# Altium project MiniBall.PrjPCB
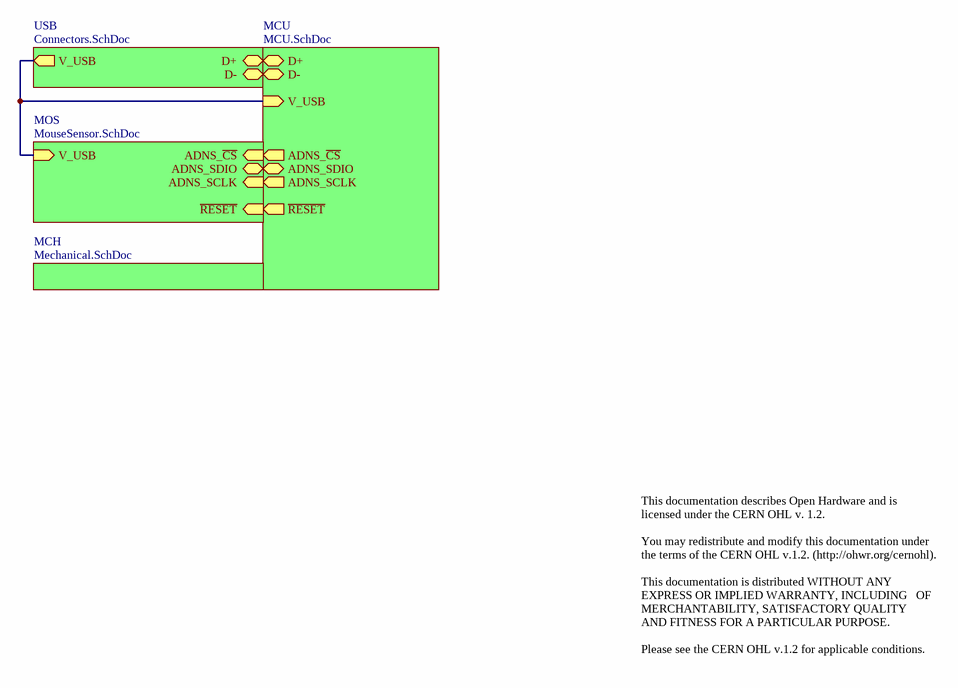
[diagram p0: MiniBall.SchDoc]
5 sheets, 44 parts. Net scope: hierarchical (ports join the sheet entries above them; power ports are global).
Board file: MiniBall.PcbDoc
Sheets:
  MiniBall.SchDoc
    USB = Connectors.SchDoc
    MCU = MCU.SchDoc
    MCH = Mechanical.SchDoc
    MOS = MouseSensor.SchDoc

## Sheet MiniBall.SchDoc
size Letter; CompanyName: Ploopy Corporation; Organization: Ploopy Corporation; Address1: 137-1140 Burnhamthorpe Road W; Address2: Mississauga; Address3: Ontario; Address4: Canada L5C 0A3; DocumentNumber: 1; Revision: R1.001; SheetNumber: 1; SheetTotal: 5

### Sub-sheets
MCH = Mechanical.SchDoc: no entries
MCU = MCU.SchDoc: D+ (bidir), D- (bidir), V_USB (in), ~{RESET} (out), ADNS_SDIO (bidir), ADNS_~{CS} (out), ADNS_SCLK (out)
MOS = MouseSensor.SchDoc: ~{RESET} (in), V_USB (in), ADNS_~{CS} (in), ADNS_SDIO (bidir), ADNS_SCLK (in)
USB = Connectors.SchDoc: D+ (bidir), V_USB (out), D- (bidir)

### Nets
~{RESET}: sheet MCU/~{RESET}, sheet MOS/~{RESET}
V_USB: sheet USB/V_USB, sheet MCU/V_USB, sheet MOS/V_USB
NetR6_2: sheet USB/D-, sheet MCU/D-
NetR7_2: sheet USB/D+, sheet MCU/D+
NetU1_12: sheet MCU/ADNS_SCLK, sheet MOS/ADNS_SCLK
NetU1_28: sheet MCU/ADNS_~{CS}, sheet MOS/ADNS_~{CS}
NetU1_31: sheet MCU/ADNS_SDIO, sheet MOS/ADNS_SDIO

### Notes on the sheet
- This documentation describes Open Hardware and is licensed under the CERN OHL v. 1.2.
  You may redistribute and modify this documentation under the terms of the CERN OHL v.1.2. (http://ohwr.org/cernohl).
  This documentation is distributed WITHOUT ANY EXPRESS OR IMPLIED WARRANTY, INCLUDING   OF MERCHANTABILITY, SATISFACTORY QUALITY   AND FITNESS FOR A PARTICULAR PURPOSE.
  Please see the CERN OHL v.1.2 for applicable conditions.
- Copyright Ploopy Corporation 2021
- Licensed under the CERN OHL v. 1.2
- http://ohwr.org/cernohl
- Title:
- PCB:
- Version:
- Ploopy Corporation
- Mississauga ON L5C 0A3
- 137-1140 Burnhamthorpe Road W
- Date:
- Time:
- Sheet
- of
- Canada

## Sheet Connectors.SchDoc
size Letter; CompanyName: Ploopy Corporation; Organization: Ploopy Corporation; Address1: 137-1140 Burnhamthorpe Road W; Address2: Mississauga; Address3: Ontario; Address4: Canada L5C 0A3; DocumentNumber: 2; Revision: R1.001; SheetNumber: 2; SheetTotal: 5
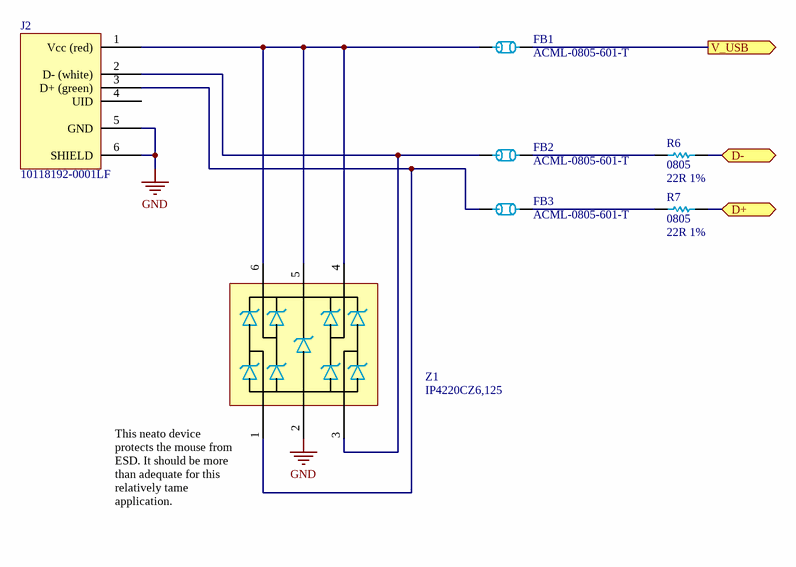
[diagram p1: Connectors.SchDoc]

### Parts
FB1  ACML-0805-601-T  [0805]
FB2  ACML-0805-601-T  [0805]
FB3  ACML-0805-601-T  [0805]
J2  10118192-0001LF  [10118192-0001LF]
R6  0805  value 22R 1%  [0805]
R7  0805  value 22R 1%  [0805]
Z1  IP4220CZ6,125  [PESD3V3S4UD - SOT95P275X110-6N]

### Ports
D+ (bidir), D- (bidir), V_USB (out)

### Nets
GND: J2.5(GND) J2.6(SHIELD) Z1.2
V_USB: FB1.2 ; port V_USB
NetFB1_1: FB1.1 J2.1(Vcc_(red)) Z1.4 Z1.5 Z1.6
NetFB2_1: FB2.1 J2.2(D-_(white)) Z1.3
NetFB2_2: FB2.2 R6.1
NetFB3_1: FB3.1 J2.3(D+_(green)) Z1.1
NetFB3_2: FB3.2 R7.1
NetR6_2: R6.2 ; port D-
NetR7_2: R7.2 ; port D+

Not connected (* = marked no-connect by the designer): J2 4(UID)

### Notes on the sheet
- (near Z1) This neato device protects the mouse from ESD. It should be more than adequate for this relatively tame application.
- Copyright Ploopy Corporation 2021
- Licensed under the CERN OHL v. 1.2
- http://ohwr.org/cernohl
- Title:
- PCB:
- Version:
- Ploopy Corporation
- Mississauga ON L5C 0A3
- 137-1140 Burnhamthorpe Road W
- Date:
- Time:
- Sheet
- of
- Canada

### Library data of the parts
FB1-FB3 = ACML-0805-601-T: FERRITE BEAD 600 OHM 0805 1LN; Value: Ferrite Bead 600R; Supplier 1: Digi-Key; Supplier Part Number 1: 535-12556-1-ND
J2 = 10118192-0001LF: CONN RCPT USB2.0 MICRO B SMD R/A
R6 R7 = Res 22R 1% 0805: Chip resistor; Supplier 1: Digi-Key; Supplier 2: Arrow; Supplier Part Number 1: RMCF0805FT22R0CT-ND; Supplier Part Number 2: RMCF0805FT22R0
Z1 = IP4220CZ6,125: TVS DIODE 5.5V 6TSOP (Low capacitance, USB); Supplier 1: Digi-Key; Supplier 2: Mouser; Supplier 3: Arrow; Supplier Part Number 1: 1727-3578-1-ND; Supplier Part Number 2: 771-IP4220CZ6-T/R; Supplier Part Number 3: IP4220CZ6,125

## Sheet MCU.SchDoc
size Legal; CompanyName: Ploopy Corporation; Organization: Ploopy Corporation; Address1: 137-1140 Burnhamthorpe Road W; Address2: Mississauga; Address3: Ontario; Address4: Canada L5C 0A3; DocumentNumber: 3; Revision: R1.001; SheetNumber: 3; SheetTotal: 5
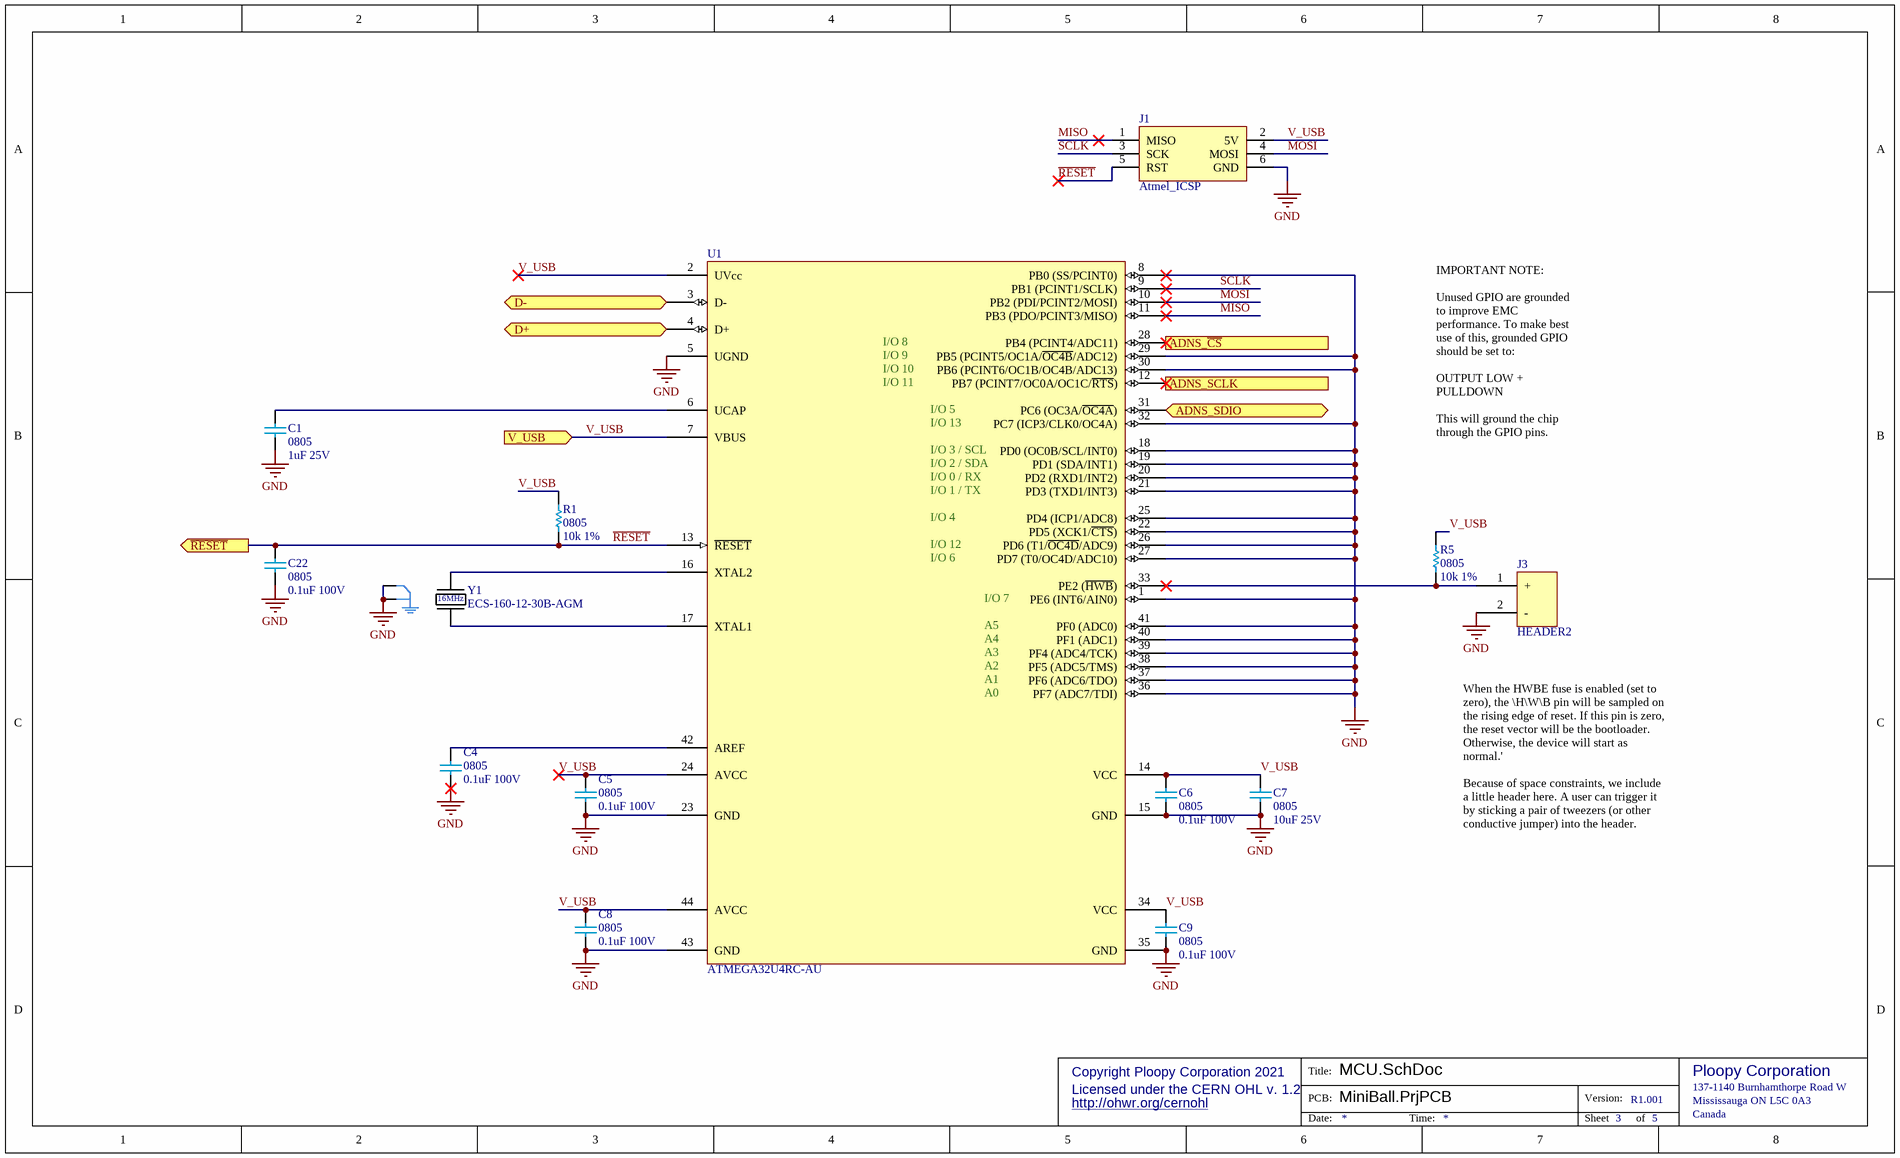
[diagram p2: MCU.SchDoc]

### Parts
C1  0805  value 1uF 25V  [0805 - TALL]
C4  0805  value 0.1uF 100V  [0805 - TALL]
C5  0805  value 0.1uF 100V  [0805 - TALL]
C6  0805  value 0.1uF 100V  [0805 - TALL]
C7  0805  value 10uF 25V  [0805 - TALL]
C8  0805  value 0.1uF 100V  [0805 - TALL]
C9  0805  value 0.1uF 100V  [0805 - TALL]
C22  0805  value 0.1uF 100V  [0805 - TALL]
J1  Atmel_ICSP  [6x2]
J3  HEADER2  [2x1]
R1  0805  value 10k 1%  [0805]
R5  0805  value 10k 1%  [0805]
U1  ATMEGA32U4RC-AU  [ATmega32U4 - TQFP80P1200X1200X120-44N]
Y1  ECS-160-12-30B-AGM  [LFXTAL055663BULK]

### Ports
ADNS_SCLK (out), ADNS_SDIO (bidir), ADNS_~{CS} (out), D+ (bidir), D- (bidir), V_USB (in), ~{RESET} (out)

### Nets
GND: C1.1 C4.1 C5.1 C6.1 C7.1 C8.1 C9.1 C22.1 J1.6(GND) J3.2(-) U1.1(PE6_(INT6/AIN0)) U1.5(UGND) U1.8(PB0_(SS/PCINT0)) U1.15(GND) U1.18(PD0_(OC0B/SCL/INT0)) U1.19(PD1_(SDA/INT1)) U1.20(PD2_(RXD1/INT2)) U1.21(PD3_(TXD1/INT3)) U1.22(PD5_(XCK1/~{CTS})) U1.23(GND) U1.25(PD4_(ICP1/ADC8)) U1.26(PD6_(T1/~{OC4D}/ADC9)) U1.27(PD7_(T0/OC4D/ADC10)) U1.29(PB5_(PCINT5/OC1A/~{OC4B}/ADC12)) U1.30(PB6_(PCINT6/OC1B/OC4B/ADC13)) U1.32(PC7_(ICP3/CLK0/OC4A)) U1.35(GND) U1.36(PF7_(ADC7/TDI)) U1.37(PF6_(ADC6/TDO)) U1.38(PF5_(ADC5/TMS)) U1.39(PF4_(ADC4/TCK)) U1.40(PF1_(ADC1)) U1.41(PF0_(ADC0)) U1.43(GND) Y1.2 Y1.4
MISO: J1.1(MISO) U1.11(PB3_(PDO/PCINT3/MISO))
MOSI: J1.4(MOSI) U1.10(PB2_(PDI/PCINT2/MOSI))
~{RESET}: C22.2 J1.5(RST) R1.1 U1.13(~{RESET}) ; port ~{RESET}
SCLK: J1.3(SCK) U1.9(PB1_(PCINT1/SCLK))
V_USB: C5.2 C6.2 C7.2 C8.2 C9.2 J1.2(5V) R1.2 R5.2 U1.2(UVcc) U1.7(VBUS) U1.14(VCC) U1.24(AVCC) U1.34(VCC) U1.44(AVCC) ; port V_USB
NetC1_2: C1.2 U1.6(UCAP)
NetC4_2: C4.2 U1.42(AREF)
NetJ3_1: J3.1(+) R5.1 U1.33(PE2_(~{HWB}))
NetR6_2: U1.3(D-) ; port D-
NetR7_2: U1.4(D+) ; port D+
NetU1_12: U1.12(PB7_(PCINT7/OC0A/OC1C/~{RTS})) ; port ADNS_SCLK
NetU1_16: U1.16(XTAL2) Y1.1
NetU1_17: U1.17(XTAL1) Y1.3
NetU1_28: U1.28(PB4_(PCINT4/ADC11)) ; port ADNS_~{CS}
NetU1_31: U1.31(PC6_(OC3A/~{OC4A})) ; port ADNS_SDIO

### Notes on the sheet
- IMPORTANT NOTE:
  Unused GPIO are grounded to improve EMC performance. To make best use of this, grounded GPIO should be set to:
  OUTPUT LOW + PULLDOWN
  This will ground the chip through the GPIO pins.
- When the HWBE fuse is enabled (set to zero), the \H\W\B pin will be sampled on the rising edge of reset. If this pin is zero, the reset vector will be the bootloader. Otherwise, the device will start as normal.'
  Because of space constraints, we include a little header here. A user can trigger it by sticking a pair of tweezers (or other conductive jumper) into the header.
- Copyright Ploopy Corporation 2021
- Licensed under the CERN OHL v. 1.2
- http://ohwr.org/cernohl
- Title:
- PCB:
- Version:
- Ploopy Corporation
- Mississauga ON L5C 0A3
- 137-1140 Burnhamthorpe Road W
- Date:
- Time:
- Sheet
- of
- Canada
- (in symbol ATMEGA32U4RC-AU) I/O 8; I/O 9; I/O 10; I/O 11; I/O 5; I/O 13; I/O 3 / SCL; I/O 2 / SDA; I/O 0 / RX; I/O 1 / TX; I/O 4; I/O 12; I/O 6; I/O 7; A5; A4; A3; A2; A1; A0
- (in symbol ECS-160-12-30B-AGM) 16MHz

### Library data of the parts
C1 = Cap 1uF 25V: 0805, X5R or better; Supplier 1: Digi-Key; Supplier Part Number 1: 1276-1066-2-ND; Supplier 2: Digi-Key; Supplier Part Number 2: 1276-1066-1-ND
C4-C6 C8 C9 C22 = Cap 0.1uF 100V: 0805, X5R or better; Supplier 1: Digi-Key; Supplier Part Number 1: 1276-6840-2-ND
C7 = Cap 10uF 25V: 0805, X5R or better; Supplier 1: Mouser; Supplier Part Number 1: 81-GRM21BR61E106KA3L; Supplier 2: Digi-Key; Supplier Part Number 2: 490-5523-1-ND
J1 = Atmel_ICSP: 6-pin 0.100" ICSP header; Supplier 1: Digi-Key; Supplier Part Number 1: S2012EC-03-ND
J3 = HEADER2: 2-pin 0.100" header; Supplier 1: Mouser; Supplier Part Number 1: 855-M20-9990245; Supplier 2: Digi-Key; Supplier Part Number 2: 952-2261-ND
R1 R5 = Res 10k 1% 0805: Chip resistor; Supplier 1: Digi-Key; Supplier Part Number 1: RMCF0805FT10K0TR-ND
U1 = ATMEGA32U4RC-AU: IC MCU 8BIT 32KB FLASH 44TQFP; PNP-Nzl: 6; PNP-dx: 0; PNP-X: 12; PNP-A: 270; PNP-Pt: 1; PNP-W: 0.1; PNP-Thk: 1.6; PNP-Lv: 126; PNP-TS: 70; PNP-Level: 1.2; PNP-Type: QFP; PNP-FeedType: Tray; PNP-PlacePriority: 3; PNP-dy: 0; PNP-Y: 12; PNP-Voff: 0; PNP-da: 0; Supplier 1: Digi-Key; Supplier 2: Mouser; Supplier 3: Arrow; Supplier Part Number 1: ATMEGA32U4RC-AU-ND; Supplier Part Number 2: 556-ATMEGA32U4RC-AU; Supplier Part Number 3: ATMEGA32U4RC-AU
Y1 = ECS-160-12-30B-AGM: 16MHz Crystal 12pF 100 Ohms 4-SMD, No Lead; Supplier 1: Digi-Key; Supplier 2: Mouser; Supplier Part Number 1: XC2686CT-ND; Supplier Part Number 2: 520-160-12-30B-AGMT

## Sheet Mechanical.SchDoc
size Letter; CompanyName: Ploopy Corporation; Organization: Ploopy Corporation; Address1: 137-1140 Burnhamthorpe Road W; Address2: Mississauga; Address3: Ontario; Address4: Canada L5C 0A3; DocumentNumber: 4; Revision: R1.001; SheetNumber: 4; SheetTotal: 5
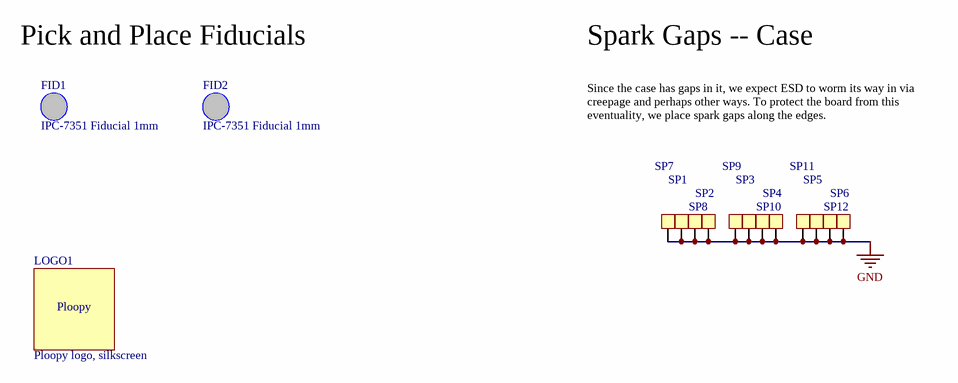
[diagram p3: Mechanical.SchDoc]

### Parts
FID1  IPC-7351 Fiducial 1mm  [FIDUCIAL_1.5]
FID2  IPC-7351 Fiducial 1mm  [FIDUCIAL_1.5]
LOGO1  Ploopy logo, silkscreen  [PloopyLogo]  (no BOM)
SP1  Spark Gap  [SparkGap]  (value not drawn)  (no BOM)
SP2  Spark Gap  [SparkGap]  (value not drawn)  (no BOM)
SP3  Spark Gap  [SparkGap]  (value not drawn)  (no BOM)
SP4  Spark Gap  [SparkGap]  (value not drawn)  (no BOM)
SP5  Spark Gap  [SparkGap]  (value not drawn)  (no BOM)
SP6  Spark Gap  [SparkGap]  (value not drawn)  (no BOM)
SP7  Spark Gap  [SparkGap]  (value not drawn)  (no BOM)
SP8  Spark Gap  [SparkGap]  (value not drawn)  (no BOM)
SP9  Spark Gap  [SparkGap]  (value not drawn)  (no BOM)
SP10  Spark Gap  [SparkGap]  (value not drawn)  (no BOM)
SP11  Spark Gap  [SparkGap]  (value not drawn)  (no BOM)
SP12  Spark Gap  [SparkGap]  (value not drawn)  (no BOM)

### Nets
GND: SP1.1 SP2.1 SP3.1 SP4.1 SP5.1 SP6.1 SP7.1 SP8.1 SP9.1 SP10.1 SP11.1 SP12.1

Not connected (* = marked no-connect by the designer): FID1 1; FID2 1

### Notes on the sheet
- Pick and Place Fiducials
- Spark Gaps -- Case
- Since the case has gaps in it, we expect ESD to worm its way in via creepage and perhaps other ways. To protect the board from this eventuality, we place spark gaps along the edges.
- Copyright Ploopy Corporation 2021
- Licensed under the CERN OHL v. 1.2
- http://ohwr.org/cernohl
- Title:
- PCB:
- Version:
- Ploopy Corporation
- Mississauga ON L5C 0A3
- 137-1140 Burnhamthorpe Road W
- Date:
- Time:
- Sheet
- of
- Canada
- (in symbol PloopyLogo) Ploopy

### Library data of the parts
FID1 FID2 = FIDUCIAL_1.5: PNP-Nzl: 2; PNP-dx: 0; PNP-X: 4; PNP-A: 1; PNP-Thk: 1.02; PNP-TS: 70; PNP-Type: MARK1; PNP-dy: 0; PNP-Y: 4; PNP-Pt: 0; PNP-W: 0; PNP-Lv: 1; PNP-Level: 1; PNP-Voff: 0; PNP-FeedType: Fiducial; PNP-TapeWidth: 0; PNP-PlacePriority: 0; PNP-TapeIndex: 0; PNP-da: 0
LOGO1 = PloopyLogo: PNP-Nzl: 2; PNP-dx: 0; PNP-X: 1; PNP-TS: 70; PNP-Type: CHI; PNP-FeedType: Tape; PNP-TapeWidth: 8; PNP-dy: 0; PNP-Y: 1; PNP-A: 0; PNP-Pt: 0; PNP-W: 0; PNP-Thk: 1; PNP-Lv: 1; PNP-Level: 1; PNP-Voff: 0; PNP-PlacePriority: 1; PNP-TapeIndex: 1; PNP-da: 0
SP1-SP12 = Spark Gap: Open square pad for spark gapping; PNP-Nzl: 2; PNP-dx: 0; PNP-X: 1; PNP-TS: 70; PNP-Type: CHI; PNP-FeedType: Tape; PNP-TapeWidth: 8; PNP-dy: 0; PNP-Y: 1; PNP-A: 0; PNP-Pt: 0; PNP-W: 0; PNP-Thk: 1; PNP-Lv: 1; PNP-Level: 1; PNP-Voff: 0; PNP-PlacePriority: 1; PNP-TapeIndex: 1; PNP-da: 0

## Sheet MouseSensor.SchDoc
size Letter; CompanyName: Ploopy Corporation; Organization: Ploopy Corporation; Address1: 137-1140 Burnhamthorpe Road W; Address2: Mississauga; Address3: Ontario; Address4: Canada L5C 0A3; DocumentNumber: 5; Revision: R1.001; SheetNumber: 5; SheetTotal: 5
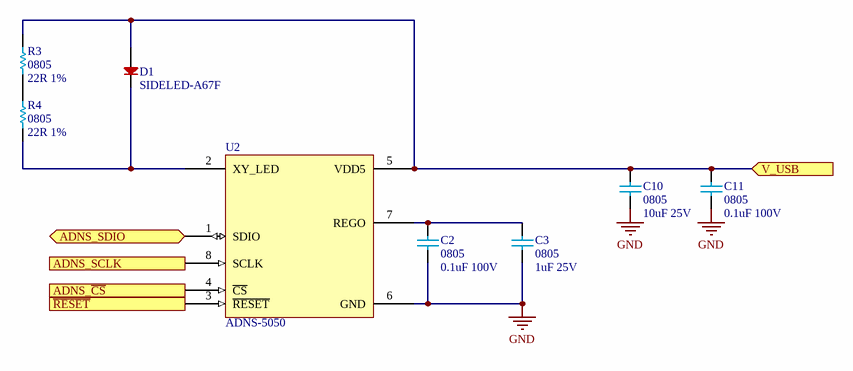
[diagram p4: MouseSensor.SchDoc]

### Parts
C2  0805  value 0.1uF 100V  [0805 - TALL]
C3  0805  value 1uF 25V  [0805 - TALL]
C10  0805  value 10uF 25V  [0805 - TALL]
C11  0805  value 0.1uF 100V  [0805 - TALL]
D1  SIDELED-A67F  [SIDELED-A67F]
R3  0805  value 22R 1%  [0805]
R4  0805  value 22R 1%  [0805]
U2  ADNS-5050  [ADNS-5050]

### Ports
ADNS_SCLK (in), ADNS_SDIO (bidir), ADNS_~{CS} (in), V_USB (in), ~{RESET} (in)

### Nets
GND: C2.1 C3.1 C10.1 C11.1 U2.6(GND)
~{RESET}: U2.3(~{RESET}) ; port ~{RESET}
V_USB: C10.2 C11.2 D1.A R3.2 U2.5(VDD5) ; port V_USB
NetC2_2: C2.2 C3.2 U2.7(REGO)
NetD1_C: D1.C R4.1 U2.2(XY_LED)
NetR3_1: R3.1 R4.2
NetU1_12: U2.8(SCLK) ; port ADNS_SCLK
NetU1_28: U2.4(~{CS}) ; port ADNS_~{CS}
NetU1_31: U2.1(SDIO) ; port ADNS_SDIO

### Notes on the sheet
- Copyright Ploopy Corporation 2021
- Licensed under the CERN OHL v. 1.2
- http://ohwr.org/cernohl
- Title:
- PCB:
- Version:
- Ploopy Corporation
- Mississauga ON L5C 0A3
- 137-1140 Burnhamthorpe Road W
- Date:
- Time:
- Sheet
- of
- Canada

### Library data of the parts
C2 C11 = Cap 0.1uF 100V: 0805, X5R or better; Supplier 1: Digi-Key; Supplier Part Number 1: 1276-6840-2-ND
C3 = Cap 1uF 25V: 0805, X5R or better; Supplier 1: Digi-Key; Supplier Part Number 1: 1276-1066-2-ND; Supplier 2: Digi-Key; Supplier Part Number 2: 1276-1066-1-ND
C10 = Cap 10uF 25V: 0805, X5R or better; Supplier 1: Mouser; Supplier Part Number 1: 81-GRM21BR61E106KA3L; Supplier 2: Digi-Key; Supplier Part Number 2: 490-5523-1-ND
D1 = SIDELED-A67F: Red/Orange/Yellow Side-facing SMT LEDs, high brightness (~2lm); Supplier 2: Digi-Key; Supplier Part Number 2: 475-3415-6-ND; Supplier 1: Digi-Key; Supplier Part Number 1: 475-3392-1-ND
R3 R4 = Res 22R 1% 0805: Chip resistor; Supplier 1: Digi-Key; Supplier 2: Arrow; Supplier Part Number 1: RMCF0805FT22R0CT-ND; Supplier Part Number 2: RMCF0805FT22R0
U2 = ADNS-5050: Optical Mouse Navigation Sensor

## Nets that join several sheets
GND: Connectors (J2.5 J2.6 Z1.2), MCU (36 pins), Mechanical (12 pins), MouseSensor (5 pins)
NetR6_2: Connectors (R6.2), MCU (U1.3)
NetR7_2: Connectors (R7.2), MCU (U1.4)
NetU1_12: MCU (U1.12), MouseSensor (U2.8)
NetU1_28: MCU (U1.28), MouseSensor (U2.4)
NetU1_31: MCU (U1.31), MouseSensor (U2.1)
~{RESET}: MCU (C22.2 J1.5 R1.1 U1.13), MouseSensor (U2.3)
V_USB: Connectors (FB1.2), MCU (14 pins), MouseSensor (5 pins)

## Assembly variants
BoM: not fitted LED.C.21 LED.C.24 LED.C.26 LED.C.28 LED.D.2 LED.D.4 LED.D.6 LED.D.8 LED.R.17 LED.R.19 MCU.C.2 MCU.C.3 MCU.J.1 MCU.J.3 REG.C.13 REG.C.15 REG.C.17